# Altium schematic sheet PATHOS_Drive.SchDoc: Maxon Drive Connector
size A4; Author: A. Kalberer; CompanyName: NTB; Organization: NTB Interstate University of Applied; Address1: Werdenbergstrasse 4; Address3: 9471 Buchs; Address4: Switzerland; DocumentNumber: 4; Revision: 0.1; SheetNumber: 4; SheetTotal: 5; Organization1: Sciences of Technology Buchs; Size: A4; ShortDescription: Connector for ESCON 50/5
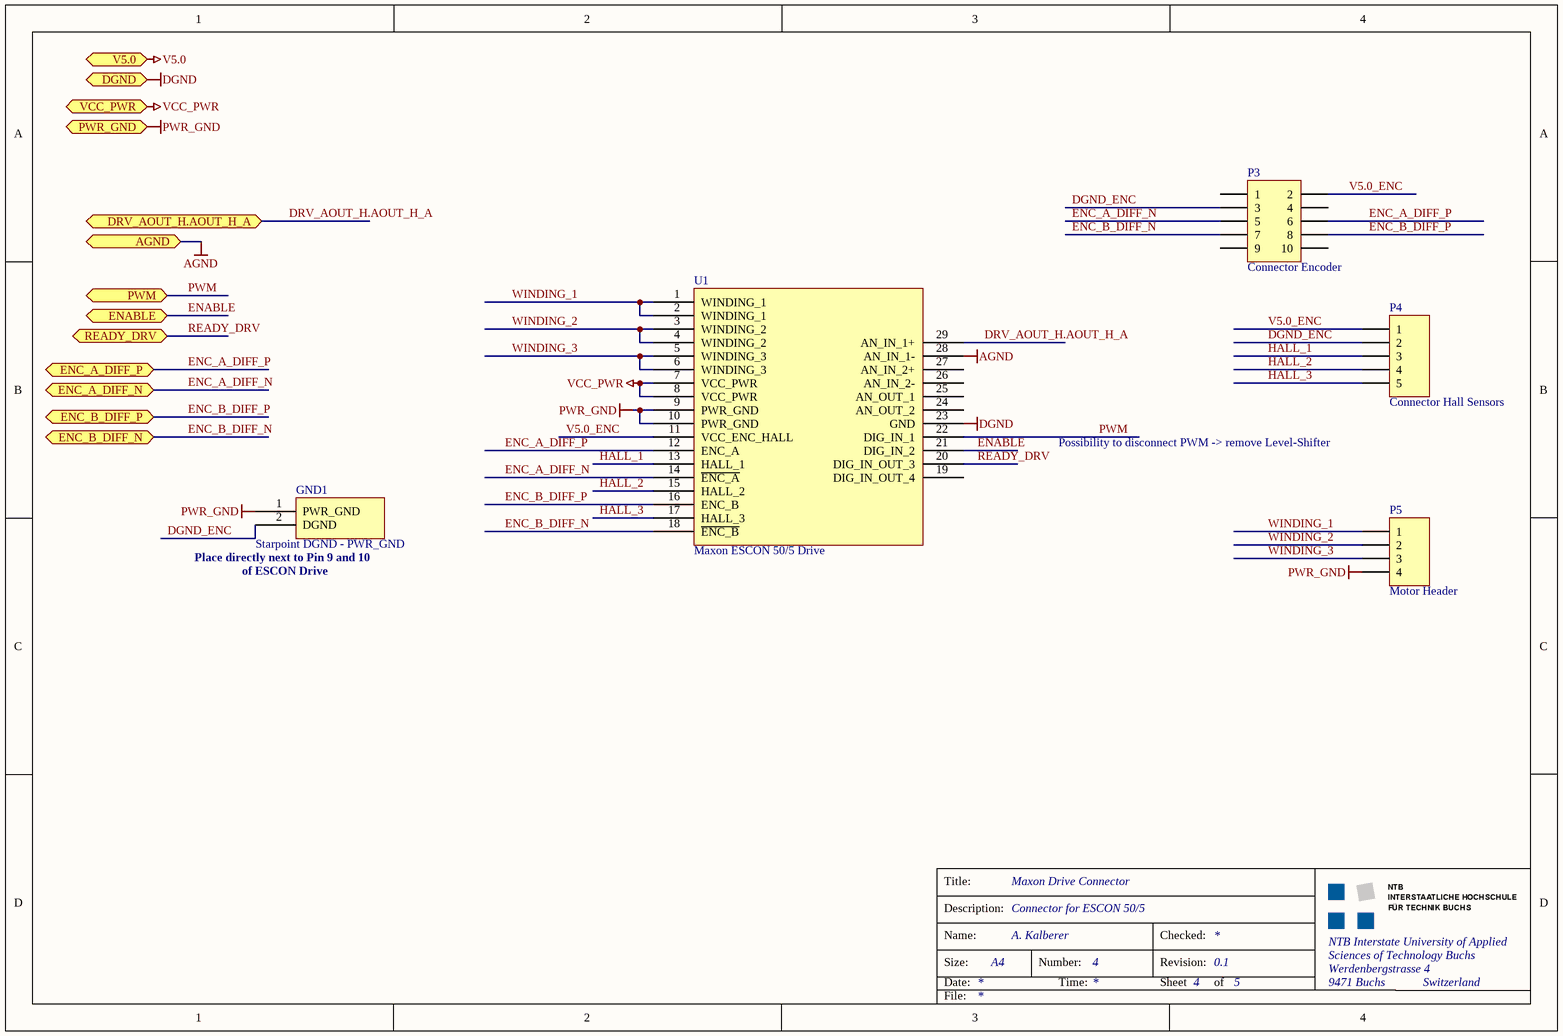
[diagram p0: PATHOS_Drive.SchDoc]

## Parts
GND1  Starpoint DGND - PWR_GND  [NetTiePWRGND]  (net tie, no BOM)
P3  Connector Encoder  [Wannenstecker 2x5 - H]
P4  Connector Hall Sensors  [PhoenixHeaderScrew_3_5mm_5pol]
P5  Motor Header  [PhoenixHeaderScrew_3_5mm_4pol]
U1  Maxon ESCON 50/5 Drive  [ESCON_MODULE_50/5]

## Ports
AGND, DGND, DRV_AOUT_H.AOUT_H_A, ENABLE, ENC_A_DIFF_N, ENC_A_DIFF_P, ENC_B_DIFF_N, ENC_B_DIFF_P, PWM, PWR_GND, READY_DRV, V5.0, VCC_PWR

## Nets
AGND: U1.28(AN_IN_1-) ; port AGND
DGND: U1.23(GND) ; port DGND
PWR_GND: GND1.1(PWR_GND) P5.4 U1.9(PWR_GND) U1.10(PWR_GND) ; port PWR_GND
V5.0: port V5.0
VCC_PWR: U1.7(VCC_PWR) U1.8(VCC_PWR) ; port VCC_PWR
DGND_ENC: GND1.2(DGND) P3.3 P4.2
DRV_AOUT_H.AOUT_H_A: U1.29(AN_IN_1+) ; port DRV_AOUT_H.AOUT_H_A
ENABLE: U1.21(DIG_IN_2) ; port ENABLE
ENC_A_DIFF_N: P3.5 U1.14(~{ENC_A}) ; port ENC_A_DIFF_N
ENC_A_DIFF_P: P3.6 U1.12(ENC_A) ; port ENC_A_DIFF_P
ENC_B_DIFF_N: P3.7 U1.18(~{ENC_B}) ; port ENC_B_DIFF_N
ENC_B_DIFF_P: P3.8 U1.16(ENC_B) ; port ENC_B_DIFF_P
HALL_1: P4.3 U1.13(HALL_1)
HALL_2: P4.4 U1.15(HALL_2)
HALL_3: P4.5 U1.17(HALL_3)
PWM: U1.22(DIG_IN_1) ; port PWM
READY_DRV: U1.20(DIG_IN_OUT_3) ; port READY_DRV
V5.0_ENC: P3.2 P4.1 U1.11(VCC_ENC_HALL)
WINDING_1: P5.1 U1.1(WINDING_1) U1.2(WINDING_1)
WINDING_2: P5.2 U1.3(WINDING_2) U1.4(WINDING_2)
WINDING_3: P5.3 U1.5(WINDING_3) U1.6(WINDING_3)

Not connected (* = marked no-connect by the designer): P3 1 4 9 10; U1 19(DIG_IN_OUT_4) 24(AN_OUT_2) 25(AN_OUT_1) 26(AN_IN_2-) 27(AN_IN_2+)

## Notes on the sheet
- Possibility to disconnect PWM -> remove Level-Shifter
- (near GND1) Place directly next to Pin 9 and 10
- (near GND1) of ESCON Drive
- Title:
- Description:
- Size:
- Date:
- Name:
- Number:
- Time:
- Revision:
- Sheet
- Checked:
- of
- File:

## Library data of the parts
GND1 = NetTie_PWR_GND
P3 = Header 5X2: Header, 5-Pin, Dual row; LatestRevisionDate: 17-Jul-2002; LatestRevisionNote: Re-released for DXP Platform.; Publisher: Altium Limited
P4 = Header 5: Header, 5-Pin; LatestRevisionDate: 17-Jul-2002; LatestRevisionNote: Re-released for DXP Platform.; Publisher: Altium Limited
P5 = Header 4: Header, 4-Pin; LatestRevisionDate: 17-Jul-2002; LatestRevisionNote: Re-released for DXP Platform.; Publisher: Altium Limited
U1 = DRV_ESCON_50_5: Maxon Drive 4Q